# Altium schematic sheet I2C EXTERNAL.SchDoc
size Letter; SheetNumber: 15; SheetTotal: 25
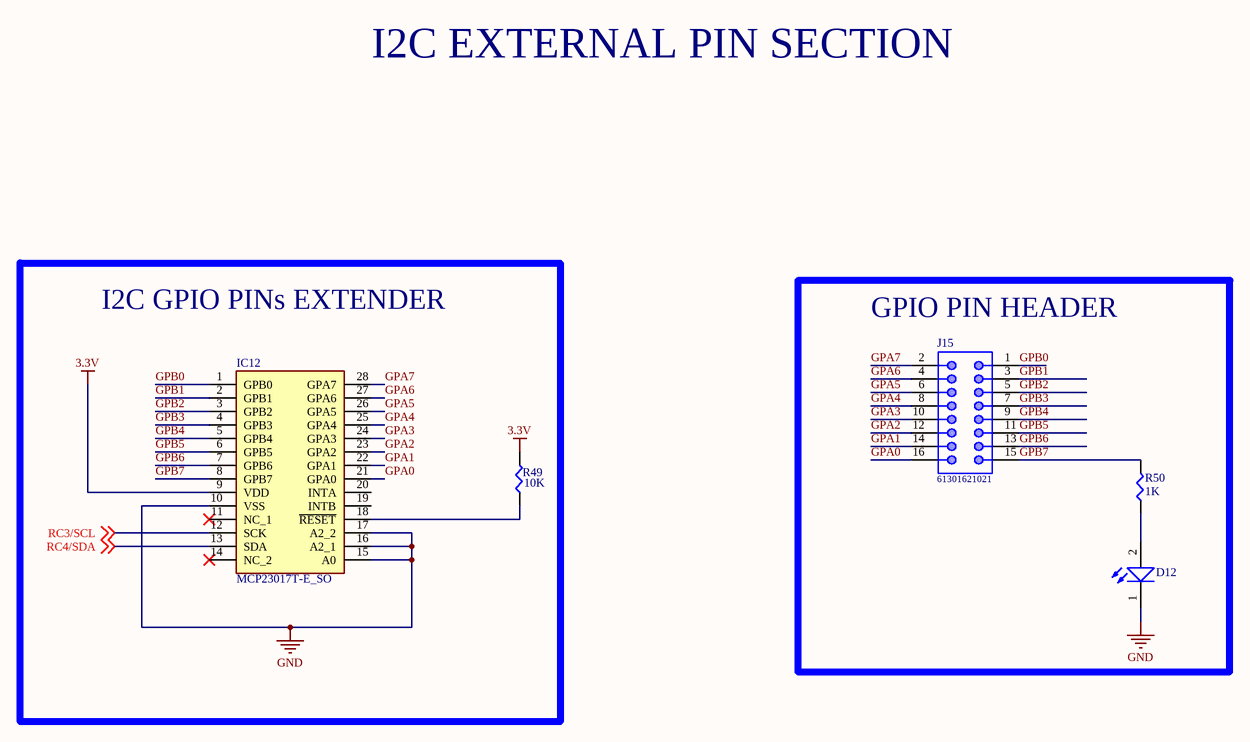
[diagram p0: I2C EXTERNAL.SchDoc]

## Parts
D12  150080BS75000  [WL-SMCW_0805]  (value not drawn)
IC12  MCP23017T-E_SO  [SOIC127P1030X265-28N]
J15  61301621021  [61301621021]
R49  10K  [SMD-0805-RES]
R50  1K  [SMD-0805-RES]

## Blocks framed on the sheet
I2C GPIO PINs EXTENDER: IC12 R49
GPIO PIN HEADER: D12 J15 R50

## Nets
3.3V: IC12.9(VDD) R49.2
GND: D12.1(K) IC12.10(VSS) IC12.15(A0) IC12.16(A2_1) IC12.17(A2_2)
GPA0: IC12.21(GPA0) J15.16
GPA1: IC12.22(GPA1) J15.14
GPA2: IC12.23(GPA2) J15.12
GPA3: IC12.24(GPA3) J15.10
GPA4: IC12.25(GPA4) J15.8
GPA5: IC12.26(GPA5) J15.6
GPA6: IC12.27(GPA6) J15.4
GPA7: IC12.28(GPA7) J15.2
GPB0: IC12.1(GPB0) J15.1
GPB1: IC12.2(GPB1) J15.3
GPB2: IC12.3(GPB2) J15.5
GPB3: IC12.4(GPB3) J15.7
GPB4: IC12.5(GPB4) J15.9
GPB5: IC12.6(GPB5) J15.11
GPB6: IC12.7(GPB6) J15.13
GPB7: IC12.8(GPB7) J15.15 R50.2
RC3/SCL: IC12.12(SCK) ; off-sheet RC3/SCL
RC4/SDA: IC12.13(SDA) ; off-sheet RC4/SDA
NetD12_2: D12.2(A) R50.1
NetIC12_18: IC12.18(~{RESET}) R49.1

Not connected (* = marked no-connect by the designer): IC12 11(NC_1)* 14(NC_2)* 19(INTB) 20(INTA)

## Notes on the sheet
- I2C EXTERNAL PIN SECTION

## Library data of the parts
D12 = 150080BS75000: WL-SMCW SMD Mono-color Chip LED Waterclear, size 0805, Blue; Forward Voltage: 3.2 V; Viewing Angle: 140°; Peak Wavelength: 465 nm; Published Date: Jan 2017; Publisher: Wurth Elektronik; ComponentLink1Description: Manufacturer; ComponentLink1URL: http://www.we-online.de; ComponentLink2Description: Datasheet; ComponentLink2URL: http://katalog.we-online.de/led/datasheet/150080BS75000.pdf; Part Number: 150080BS75000; Size: 0805; Emitting Color: Blue
IC12 = MCP23017T-E_SO: Integrated Circuit; Manufacturer_Name: Microchip; Manufacturer_Part_Number: MCP23017T-E/SO; Datasheet Link: http://ww1.microchip.com/downloads/en/DeviceDoc/20001952C.pdf; Height: 2.65mm; Mouser Part Number: 579-MCP23017T-E/SO; Mouser Price/Stock: https://www.mouser.co.uk/ProductDetail/Microchip-Technology/MCP23017T-E-SO?qs=usxtMOJb1RylPfT%252BJtgE3Q%3D%3D; Arrow Part Number: MCP23017T-E/SO; Arrow Price/Stock: https://www.arrow.com/en/products/mcp23017t-eso/microchip-technology?region=nac
J15 = 61301621021: WR-PHD Pin Header, THT, pitch 2.54mm, Dual Row, Angled, 16pin; Pin Number: 16; Gender: Male; Rated Current: 3A; Working Voltage: 250VAC; Withstanding Voltage: 500VAC; Contact Resistance: 20mOhm; ComponentLink1Description: Manufacturer; ComponentLink1URL: http://www.we-online.de; ComponentLink2Description: Datasheet; ComponentLink2URL: https://katalog.we-online.de/em/datasheet/6130xx21021.pdf; Part Number: 61301621021; Published Date: June 2019; Publisher: Wurth Elektronik; Pitch: 2.54mm; Operating Temperature: -40 to +105degC; Mounting Technology: THT; Packaging: Bag; Row Number: Dual; Orientation: Angled
R49 R50 = ERJ-6ENF1001V: RES SMD 1K OHM 1% 1/8W 0805; Manufacturer: Panasonic Electronic Components; Factory Stock: 0; Unit Price (USD): 0.00729; @ qty: 1500; Minimum Quantity: 1; Power (Watts): 0.125W, 1/8W; Temperature Coefficient: ±100ppm/°C; Part Number: ERJ-6ENF1001V; Datasheets: http://industrial.panasonic.com/www-cgi/jvcr13pz.cgi?E+PZ+3+AOA0002+ERJ6ENF1001V+7+WW; Image: //media.digikey.com/Renders/Panasonic%20Renders/ERJ-0805%20Pkg.jpg; Digi-Key Part Number: P1.00KCCT-ND; Quantity Available: 12895103; Packaging: Cut Tape (CT); Series: ERJ; Part Status: Active; Value: 1k; Tolerance: ±1%; Composition: Thick Film; Features: Automotive AEC-Q200; Operating Temperature: -55°C ~ 155°C; Package / Case: 0805 (2012 Metric); Supplier Device Package: 0805; Size / Dimension: 0.079" L x 0.049" W (2.00mm x 1.25mm); Height - Seated (Max): 0.028" (0.70mm); Number of Terminations: 2; Failure Rate: -